# Altium schematic sheet Ethernet.SchDoc
size A4
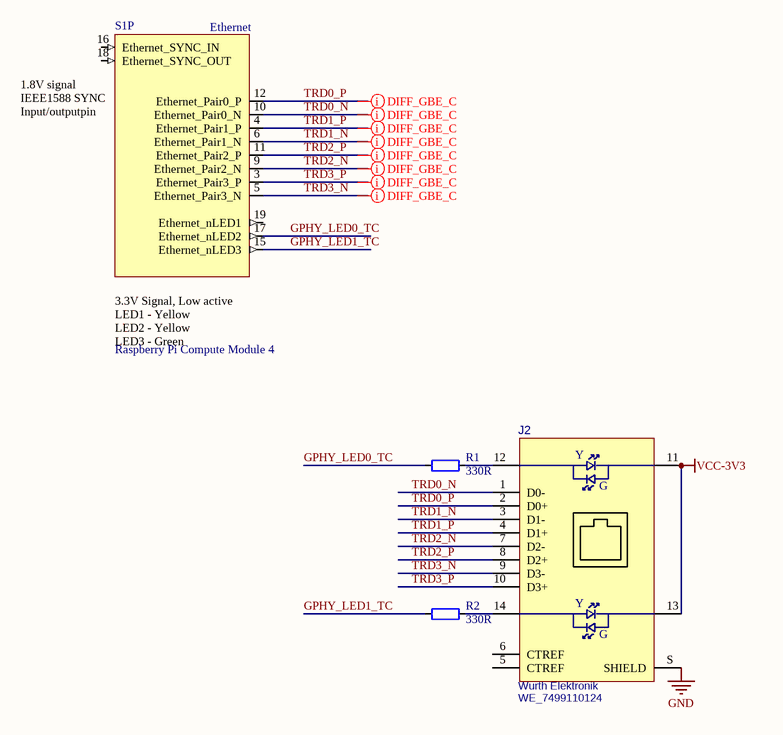
[diagram p0: Ethernet.SchDoc]

## Parts
J2  Manufacturer: Wurth Elektronik  [GE-SOCKET]  (hidden comment: WE_7499110124)
R1  330R  [RES_0402]
R2  330R  [RES_0402]
S1  Raspberry Pi Compute Module 4  [CM4-F40C-100DS-0.4v_1.5mm_0mm]  (part P of 21)

## Nets
GND: J2.S(SHIELD)
VCC-3V3: J2.11 J2.13
GPHY_LED0_TC: R1.2 S1.17(Ethernet_nLED2)
GPHY_LED1_TC: R2.2 S1.15(Ethernet_nLED3)
TRD0_N: J2.1(D0-) S1.10(Ethernet_Pair0_N)
TRD0_P: J2.2(D0+) S1.12(Ethernet_Pair0_P)
TRD1_N: J2.3(D1-) S1.6(Ethernet_Pair1_N)
TRD1_P: J2.4(D1+) S1.4(Ethernet_Pair1_P)
TRD2_N: J2.7(D2-) S1.9(Ethernet_Pair2_N)
TRD2_P: J2.8(D2+) S1.11(Ethernet_Pair2_P)
TRD3_N: J2.9(D3-) S1.5(Ethernet_Pair3_N)
TRD3_P: J2.10(D3+) S1.3(Ethernet_Pair3_P)
NetJ2_12: J2.12 R1.1
NetJ2_14: J2.14 R2.1

Not connected (* = marked no-connect by the designer): J2 5(CTREF) 6(CTREF); S1 16(Ethernet_SYNC_IN) 18(Ethernet_SYNC_OUT) 19(Ethernet_nLED1)

## Layout directives
differential pair; differential pair class DIFF_100Ohm_GBE; differential pair class DIFF_LAN_GB; net class GBE_1Gbps: TRD0_N, TRD0_P, TRD1_N, TRD1_P, TRD2_N, TRD2_P, TRD3_N, TRD3_P

## Notes on the sheet
- Title
- Size:
- Date:
- A4
- Number:
- Time:
- Revision:
- Sheet
- of
- Q-Wave Systems Co.,Ltd
- 65/2 Moo 1 Beung
- Sriracha Chonburi
- Thailand
- File:
- (in symbol CM4, part P) Ethernet; 1.8V signal / IEEE1588 SYNC Input/outputpin; by Amornthep Phunsin; 3.3V Signal, Low active / LED1 - Yellow / LED2 - Yellow / LED3 - Green
- (in symbol GE-SOCKET) Y; G

## Library data of the parts
J2 = GE-SOCKET: LAN-Transformer WE-RJ45LAN 10/100/1000 BaseT; PartNumber: WE_7499110124; Value: WE_7499110124; PartSymbol: WE_7499110124
R1 R2 = 电阻-0402: Resistor; Value: 22R
S1 = CM4: Raspberry Pi Compute Module 4 by Amornthep Phunsin